# Altium schematic sheet mems.SchDoc
size A4
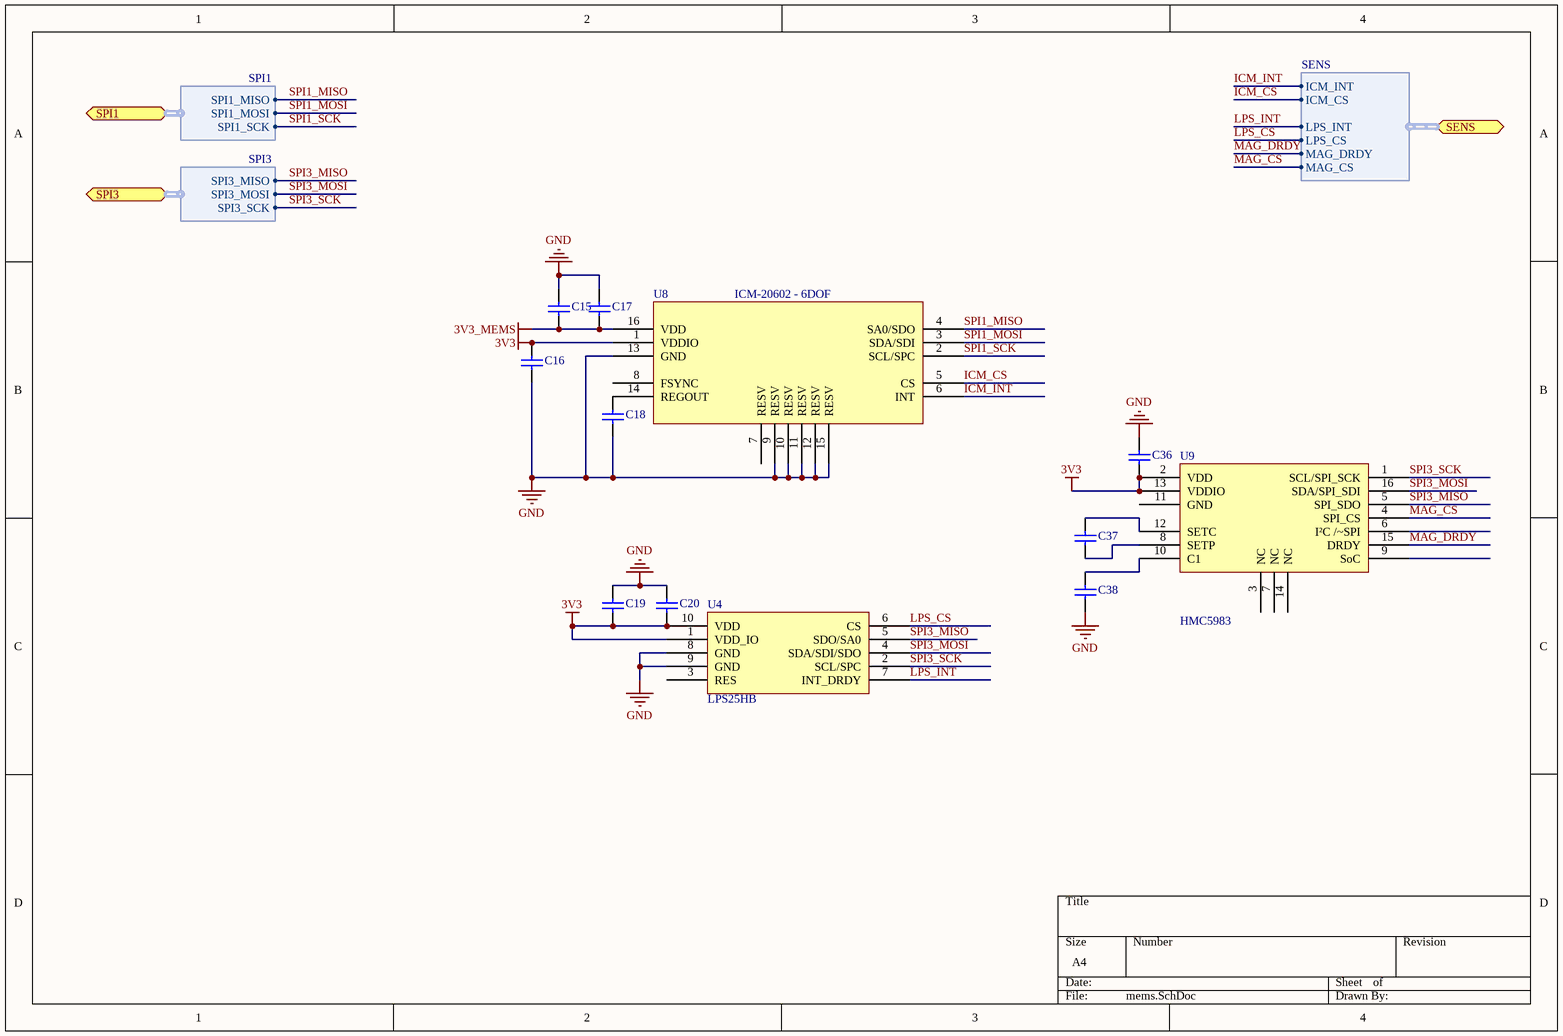
[diagram p0: mems.SchDoc]

## Parts
C15  CAP 100nF 35V 0402(1005)  [CAPC0402(1005)60_M]  (value not drawn)
C16  CAP 10nF 35V 0402(1005)  [CAPC0402(1005)60_M]  (value not drawn)
C17  CAP 2.2uF 16V 0603(1608)  [CAPC0603(1608)55_L]  (value not drawn)
C18  CAP 100nF 25V 0402(1005)  [CAPC0402(1005)60_L]  (value not drawn)
C19  CAP 1uF 6.3V 0603(1608)  [CAPC0603(1608)100_L]  (value not drawn)
C20  CAP 100nF 35V 0402(1005)  [CAPC0402(1005)60_L]  (value not drawn)
C36  CAP 100nF 35V 0402(1005)  [CAPC0402(1005)60_L]  (value not drawn)
C37  CAP 220nF 25V 0402(1005)  [CAPC0402(1005)60_L]  (value not drawn)
C38  CAP 4.7uF 16V 0603(1608)  [CAPC0603(1608)100_L]  (value not drawn)
U4  LPS25HB  [HLGA10]
U8  ICM-20602 - 6DOF  [LCC16]
U9  HMC5983  [LCC16]

## Ports
SENS (harness SENS), SPI1 (harness SPI1), SPI3 (harness SPI3)

## Harnesses
SPI1: SPI1_MISO, SPI1_MOSI, SPI1_SCK
SENS: ICM_INT, ICM_CS, LPS_INT, LPS_CS, MAG_DRDY, MAG_CS
SPI3: SPI3_MISO, SPI3_MOSI, SPI3_SCK

## Nets
3V3: C16.2 C19.1 C20.1 C36.1 U4.1(VDD_IO) U4.10(VDD) U8.1(VDDIO) U9.2(VDD) U9.13(VDDIO)
3V3_MEMS: C15.1 C17.1 U8.16(VDD)
GND: C15.2 C16.1 C17.2 C18.1 C19.2 C20.2 C36.2 C38.1 U4.8(GND) U4.9(GND) U8.9(RESV) U8.10(RESV) U8.11(RESV) U8.12(RESV) U8.13(GND) U8.15(RESV)
ICM_CS: U8.5(CS) ; port SENS.ICM_CS
ICM_INT: U8.6(INT) ; port SENS.ICM_INT
LPS_CS: U4.6(CS) ; port SENS.LPS_CS
LPS_INT: U4.7(INT_DRDY) ; port SENS.LPS_INT
MAG_CS: U9.4(SPI_CS) ; port SENS.MAG_CS
MAG_DRDY: U9.15(DRDY) ; port SENS.MAG_DRDY
SPI1_MISO: U8.4(SA0/SDO) ; port SPI1.SPI1_MISO
SPI1_MOSI: U8.3(SDA/SDI) ; port SPI1.SPI1_MOSI
SPI1_SCK: U8.2(SCL/SPC) ; port SPI1.SPI1_SCK
SPI3_MISO: U4.5(SDO/SA0) U9.5(SPI_SDO) ; port SPI3.SPI3_MISO
SPI3_MOSI: U4.4(SDA/SDI/SDO) U9.16(SDA/SPI_SDI) ; port SPI3.SPI3_MOSI
SPI3_SCK: U4.2(SCL/SPC) U9.1(SCL/SPI_SCK) ; port SPI3.SPI3_SCK
NetC18_2: C18.2 U8.14(REGOUT)
NetC37_1: C37.1 U9.12(SETC)
NetC37_2: C37.2 U9.8(SETP)
NetC38_2: C38.2 U9.10(C1)

Not connected (* = marked no-connect by the designer): U4 3(RES); U8 7(RESV) 8(FSYNC); U9 3(NC) 6(I²C_/~SPI) 7(NC) 9(SoC) 11(GND) 14(NC)

## Library data of the parts
C15 C20 C36 = CMP-1034-02075-1: CAP 100nF 35V ±10% 0402 (1005 Metric) Thickness 0.6mm SMD; Case-Metric: 1005; Case-EIA: 0402; Tolerance: Â±10%; Max Thickness: 0.6 mm; Value: 100nF; Technology: SMT; Rated Voltage: 35 V
C16 = CMP-1034-01883-1: CAP 10nF 35V ±10% 0402 (1005 Metric) Thickness 0.6mm SMD; Tolerance: Â±10%; Case-Metric: 1005; Case-EIA: 0402; Rated Voltage: 35 V; Technology: SMT; Value: 10nF; Max Thickness: 0.6 mm
C17 = CMP-1035-02764-1: CAP 2.2uF 16V ±20% 0603 (1608 Metric) Thickness 0.55mm SMD; Tolerance: Â±20%; Case-Metric: 1608; Case-EIA: 0603; Value: 2.2uF; Rated Voltage: 16 V; Max Thickness: 0.55 mm; Technology: SMT
C18 = CMP-1034-02073-1: CAP 100nF 25V ±20% 0402 (1005 Metric) Thickness 0.6mm SMD; Tolerance: Â±20%; Case-EIA: 0402; Case-Metric: 1005; Rated Voltage: 25 V; Value: 100nF; Max Thickness: 0.6 mm; Technology: SMT
C19 = CMP-1035-02731-1: CAP 1uF 6.3V ±20% 0603 (1608 Metric) Thickness 1mm SMD; Case-EIA: 0603; Tolerance: Â±20%; Case-Metric: 1608; Value: 1uF; Technology: SMT; Max Thickness: 1 mm; Rated Voltage: 6.3 V
C37 = CMP-1034-02093-1: CAP 220nF 25V ±20% 0402 (1005 Metric) Thickness 0.6mm SMD; Case-EIA: 0402; Case-Metric: 1005; Tolerance: Â±20%; Rated Voltage: 25 V; Value: 220nF; Technology: SMT; Max Thickness: 0.6 mm
C38 = CMP-1035-02789-1: CAP 4.7uF 16V ±20% 0603 (1608 Metric) Thickness 1mm SMD; Case-EIA: 0603; Tolerance: Â±20%; Case-Metric: 1608; Max Thickness: 1 mm; Rated Voltage: 16 V; Technology: SMT; Value: 4.7uF
U8 = ICM-20602
U9 = HMC5983: HMC5983 - 3 axis Compass